# Altium project Optosense_v2.PrjPcb
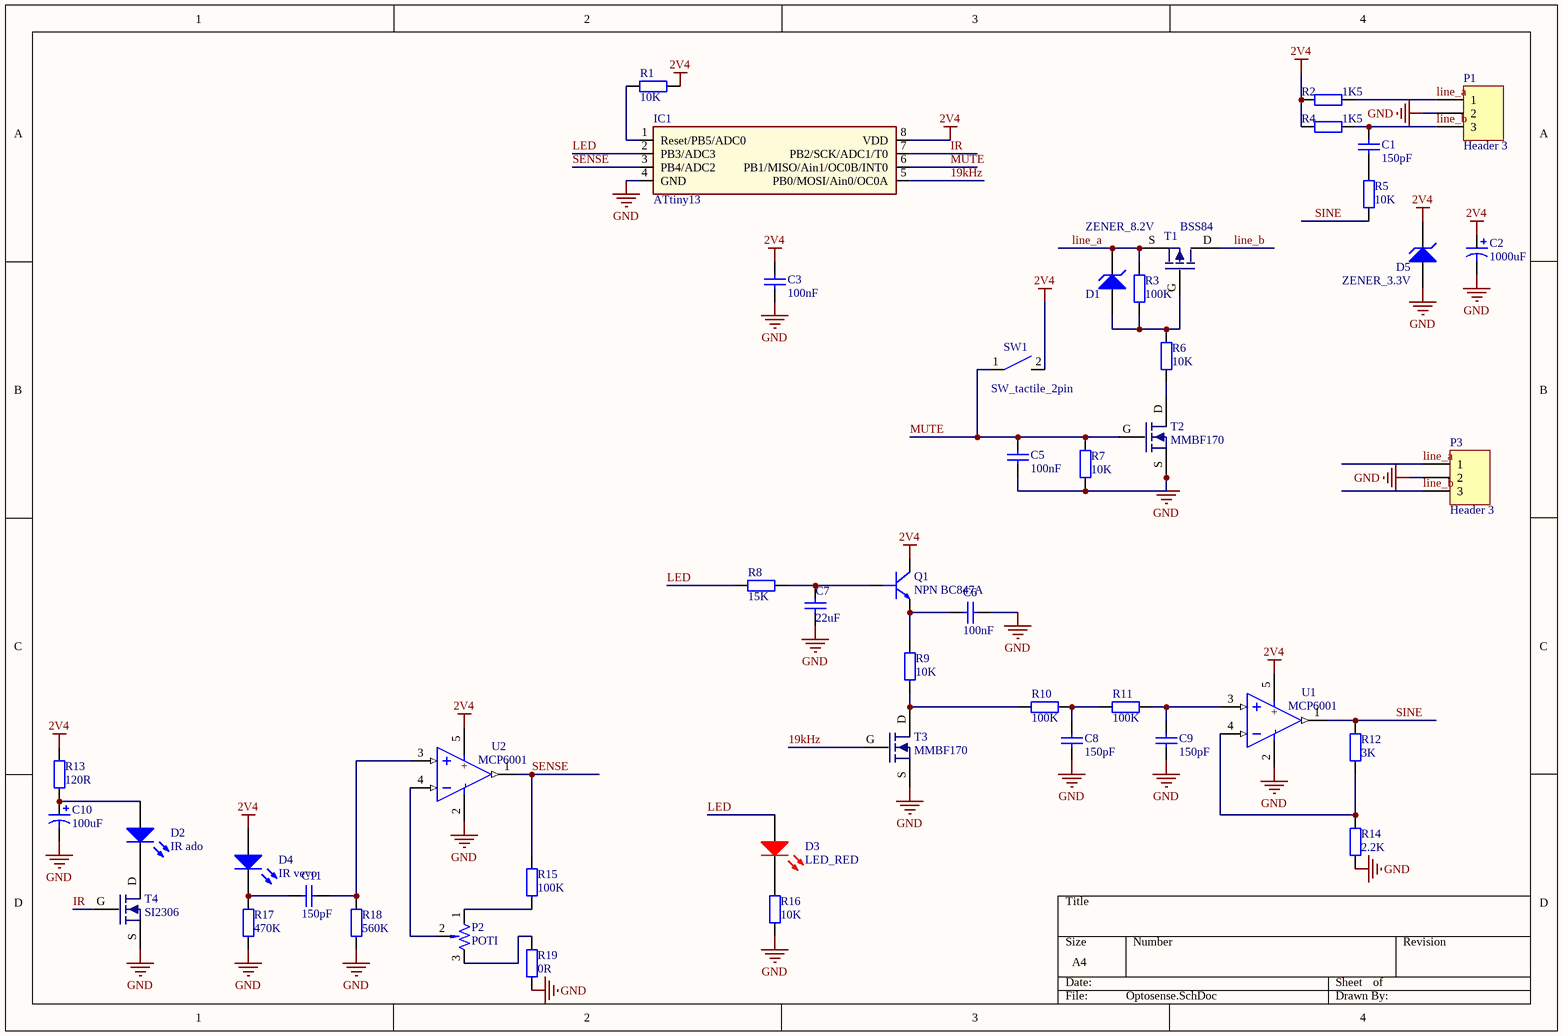
[diagram p0: Optosense.SchDoc]
1 sheet, 46 parts. Net scope: global (net labels, ports and power ports of the same name join across sheets).
Board file: Optosense.PcbDoc

## Sheet Optosense.SchDoc
size A4

### Parts
C1  150pF  [FP_0603_CAP_080]
C2  1000uF  [CAP_8x11_fekvo]
C3  100nF  [FP_0603_CAP_080]
C5  100nF  [FP_0603_CAP_080]
C6  100nF  [FP_0603_CAP_080]
C7  22uF  [FP_1206_CAP_125]
C8  150pF  [FP_0603_CAP_080]
C9  150pF  [FP_0603_CAP_080]
C10  100uF  [FP_3528]
C11  150pF  [FP_0603_CAP_080]
D1  ZENER_8.2V  [SOD-80]
D2  IR ado  [LED_IR_5mm]
D3  LED_RED  [led_3mm_standing R]
D4  IR vevo  [LED_IR_5mm]
D5  ZENER_3.3V  [SOD-80]
IC1  ATtiny13  [WSON_n_SOIC8]
P1  Header 3  [HDR1X3]  (no BOM)
P2  POTI  [RES_trimmer_helipot_mini_90]
P3  Header 3  [HDR1X3]  (no BOM)
Q1  NPN BC847A  [TR_SOT23]
R1  10K  [FP_0603_RES]
R2  1K5  [FP_0603_RES]
R3  100K  [FP_0603_RES]
R4  1K5  [FP_0603_RES]
R5  10K  [FP_0603_RES]
R6  10K  [FP_0603_RES]
R7  10K  [FP_0603_RES]
R8  15K  [FP_0603_RES]
R9  10K  [FP_0603_RES]
R10  100K  [FP_0603_RES]
R11  100K  [FP_0603_RES]
R12  3K  [FP_0603_RES]
R13  120R  [FP_0603_RES]
R14  2.2K  [FP_0603_RES]
R15  100K  [FP_0603_RES]
R16  10K  [FP_0603_RES]
R17  470K  [FP_0603_RES]
R18  560K  [FP_0603_RES]
R19  0R  [FP_0603_RES]
SW1  SW_tactile_2pin  [SW_TACT_2PIN]
T1  BSS84  [FET_SOT23]
T2  MMBF170  [FET_SOT23]
T3  MMBF170  [FET_SOT23]
T4  SI2306  [FET_SOT23]
U1  MCP6001  [ANALOG_SOT23-5]
U2  MCP6001  [ANALOG_SOT23-5]

### Nets
2V4: C2.P C3.2 D4.A D5.K IC1.8(VDD) Q1.C R1.1 R2.1 R4.1 R13.2 SW1.2 U1.5(+) U2.5(+)
GND: C2.N C3.1 C5.1 C6.1 C7.1 C8.1 C9.1 C10.N D5.A IC1.4(GND) P1.2 P3.2 R7.2 R14.2 R16.1 R17.1 R18.1 R19.1 T2.S T3.S T4.S U1.2(-) U2.2(-)
19kHz: IC1.5(PB0/MOSI/Ain0/OC0A) T3.G
IR: IC1.7(PB2/SCK/ADC1/T0) T4.G
LED: D3.A IC1.2(PB3/ADC3) R8.2
line_a: D1.K P1.1 P3.1 R2.2 R3.1 T1.S
line_b: C1.2 P1.3 P3.3 R4.2 T1.D
MUTE: C5.2 IC1.6(PB1/MISO/Ain1/OC0B/INT0) R7.1 SW1.1 T2.G
SENSE: IC1.3(PB4/ADC2) R15.2 U2.1(OUT1)
SINE: R5.1 R12.1 U1.1(OUT1)
NetC1_1: C1.1 R5.2
NetC6_2: C6.2 Q1.E R9.1
NetC7_2: C7.2 Q1.B R8.1
NetC8_2: C8.2 R10.1 R11.2
NetC9_2: C9.2 R11.1 U1.3(IN1+)
NetC10_P: C10.P D2.A R13.1
NetC11_1: C11.1 D4.K R17.2
NetC11_2: C11.2 R18.2 U2.3(IN1+)
NetD1_A: D1.A R3.2 R6.1 T1.G
NetD2_K: D2.K T4.D
NetD3_K: D3.K R16.2
NetIC1_1: IC1.1(Reset/PB5/ADC0) R1.2
NetP2_1: P2.1 R15.1
NetP2_2: P2.2(t) U2.4(IN1-)
NetP2_3: P2.3 R19.2
NetR6_2: R6.2 T2.D
NetR9_2: R9.2 R10.2 T3.D
NetR12_2: R12.2 R14.1 U1.4(IN1-)

### Library data of the parts
C1 C3 C5 C6 C8 C9 C11 = CAP: Capacitor
  C1 C8 C9 C11: Value: 150pF; Order info: 82-08-61
  C3 C5 C6: Value: 100nF; Order info: 82-04-85
C2 C10 = CAP_ELECT: Polarized Capacitor
  C2: Value: 1000uF; Order info: 12-19-15
  C10: Value: 100uF; Order info: 92-01-02
C7 = Cap: Capacitor; Tűrés: 10%; Value: 22uF; Order info: 82-08-07
D1 = ZENER: Zener Diode; U_Z: 24; Order info: 85-01-21
D2 D4 = LED_B: Typical LED
  D2: Order info: 38-02-21
  D4: Order info: 38-01-91
D3 = LED_R: Typical LED; Order info: 34-06-65
D5 = ZENER: Zener Diode; Order info: 85-01-11
P1 P3 = Header 3: Header, 3-Pin; Order info: forrpont; LatestRevisionDate: 17-Jul-2002; LatestRevisionNote: Re-released for DXP Platform.; Publisher: Altium Limited
P2 = POTI: SET: 0.5; PSpiceTemplate: RT^@REFDES %1 %t {(@VALUE*(1-@SET))+.001}\nRB^@REFDES %t %2 {(@VALUE*@SET)+.001}; Order info: 05-05-89
Q1 = NPN: Order info: 86-03-86
R1-R19 = RES: Resistor
  R1 R5-R7 R9 R16: Value: 10K; Order info: 81-10-38
  R2 R4: Value: 1K5; Order info: 81-10-28
  R3 R10 R11 R15: Value: 100K; Order info: 81-10-50
  R8: Value: 15K; Order info: 80-12-06
  R12: Value: 3K; Order info: 81-15-24
  R13: Value: 120R; Order info: 81-12-21
  R14: Value: 2.2K; Order info: 81-10-30
  R17: Value: 470K; Order info: 81-10-58
  R18: Value: 560K; Order info: 81-10-59
  R19: Value: 0R; Order info: 81-18-05
T1 = PMOS: Order info: 86-03-04
T2-T4 = NMOS
  T2 T3: Order info: 86-01-96
  T4: Order info: 86-01-57
IC1 = ATtiny13: Order info: http://hu.farnell.com/atmel/attiny13a-ssh/mcu-8bit-attiny-20mhz-soic-8/dp/1715519
SW1 = SW_tactile_2pin: Order info: 45-07-27
U1 U2 = MCP6001: Order info: http://hu.farnell.com/microchip/mcp6001t-i-ot/op-amp-cmos-1mhz-1-8v-smd-6001/dp/4974992